# EAGLE design Controller (EAGLE 9.0.1)
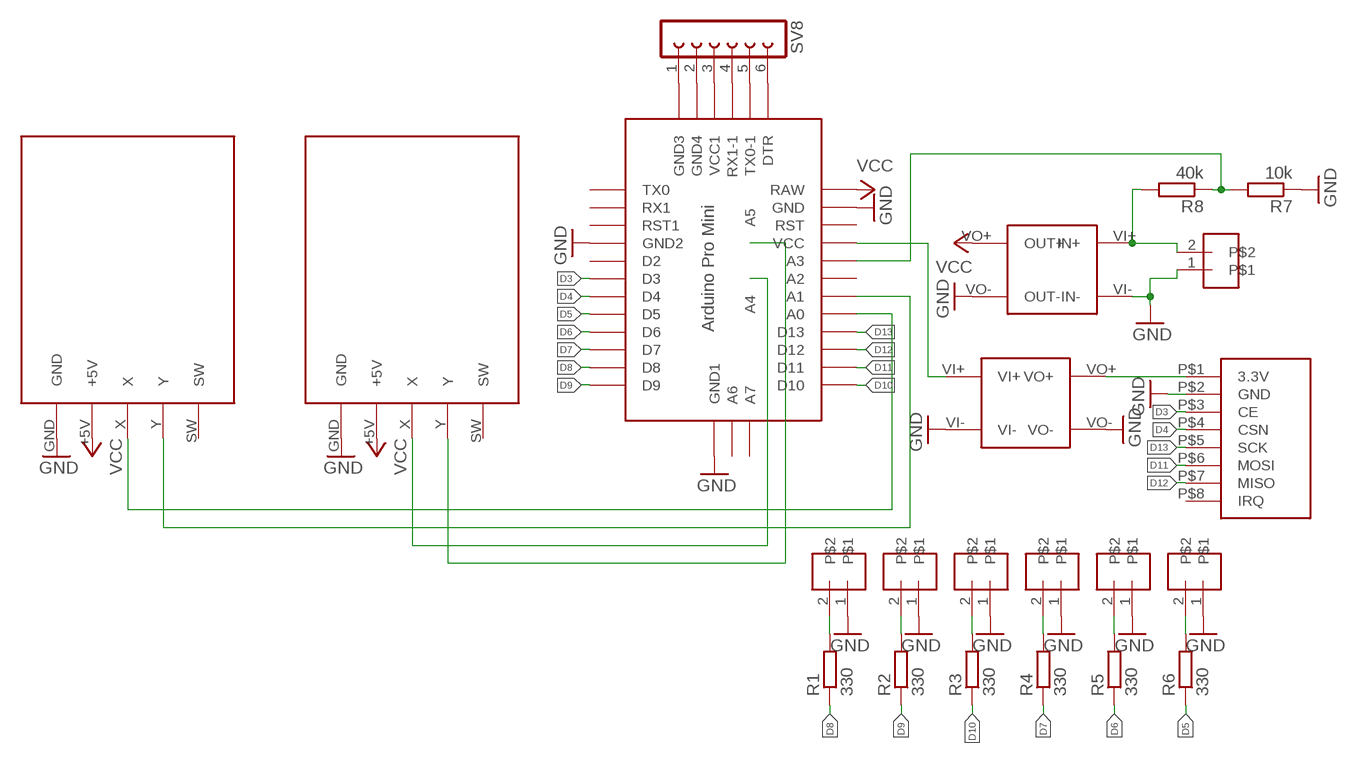
[diagram p0: schematic, sheet 1]

## Parts
R1  330  R-EU_R1206  [R1206]
R2  330  R-EU_R1206  [R1206]
R3  330  R-EU_R1206  [R1206]
R4  330  R-EU_R1206  [R1206]
R5  330  R-EU_R1206  [R1206]
R6  330  R-EU_R1206  [R1206]
R7  10k  R-EU_R1206  [R1206]
R8  40k  R-EU_R1206  [R1206]
SV1  FE05-1  [FE05-1]
SV2  FE05-1  [FE05-1]
SV3  FE05-1  [FE05-1]
SV4  FE05-1  [FE05-1]
SV5  FE05-1  [FE05-1]
SV6  FE05-1  [FE05-1]
SV7  FE05-1  [FE05-1]
SV8  FE06-1  [FE06]
U$1  JOYSTICK  [JOYSTICK]
U$2  JOYSTICK  [JOYSTICK]
U$4  ABK-PRO-MINI  [ABK-PRO-MINI]
U$5  NRF24L01  [NRF24L01]
U$7  3.3V  [3.3V]
U$8  5V  [5V]

## Nets
D3: U$4.P$12(D3) U$5.P$3(CE)
D4: U$4.P$13(D4) U$5.P$4(CSN)
D5: R6.1 U$4.P$14(D5)
D6: R5.1 U$4.P$15(D6)
D7: R4.1 U$4.P$16(D7)
D8: R1.1 U$4.P$17(D8)
D9: R2.1 U$4.P$18(D9)
D10: R3.1 U$4.P$30(D10)
D11: U$4.P$29(D11) U$5.P$6(MOSI)
D12: U$4.P$28(D12) U$5.P$7(MISO)
D13: U$4.P$27(D13) U$5.P$5(SCK)
GND: R7.1 SV1.1 SV2.1 SV3.1 SV4.1 SV5.1 SV6.1 SV7.1 U$1.GND U$2.GND U$4.P$10(GND2) U$4.P$20(GND) U$4.P$33(GND1) U$5.P$2(GND) U$7.VI- U$7.VO- U$8.VI-(IN-) U$8.VO-(OUT-)
N$1: U$1.X U$4.P$26(A0)
N$2: U$1.Y U$4.P$25(A1)
N$3: U$2.X U$4.P$35(A4)
N$4: U$2.Y U$4.P$34(A5)
N$5: R8.2 SV1.2 U$8.VI+(IN+)
N$6: U$4.P$22(VCC) U$7.VI+
N$7: U$5.P$1(3.3V) U$7.VO+
N$8: R1.2 SV7.2
N$9: R2.2 SV6.2
N$10: R3.2 SV5.2
N$11: R4.2 SV4.2
N$12: R5.2 SV3.2
N$13: R6.2 SV2.2
N$14: R7.2 R8.1 U$4.P$23(A3)
N$21: SV8.1 U$4.P$1(GND3)
N$22: SV8.2 U$4.P$2(GND4)
N$23: SV8.3 U$4.P$3(VCC1)
N$24: SV8.4 U$4.P$4(RX1-1)
N$25: SV8.5 U$4.P$5(TX0-1)
N$26: SV8.6 U$4.P$6(DTR)
VCC: U$1.+5V U$2.+5V U$4.P$19(RAW) U$8.VO+(OUT+)
Unconnected: U$1.SW U$2.SW U$4.P$7(TX0) U$4.P$8(RX1) U$4.P$9(RST1) U$4.P$11(D2) U$4.P$21(RST) U$4.P$24(A2) U$4.P$31(A7) U$4.P$32(A6) U$5.P$8(IRQ)

## Library data of the parts
R1-R8 = resistor:R-EU_: RESISTOR, European symbol
SV1-SV7 = con-lsta:FE05-1: FEMALE HEADER; OC_FARNELL: unknown; OC_NEWARK: unknown
SV8 = con-lsta:FE06-1: FEMALE HEADER; OC_FARNELL: unknown; OC_NEWARK: unknown
U$1 U$2 = joystick:JOYSTICK
U$4 = 複製 -Arduino-clone:ABK-PRO-MINI: ABK Pro-Mini Arduino Clone
U$5 = nRF24l01:NRF24L01
U$7 = DC Trans:3.3V
U$8 = DC Trans:5V

## Board
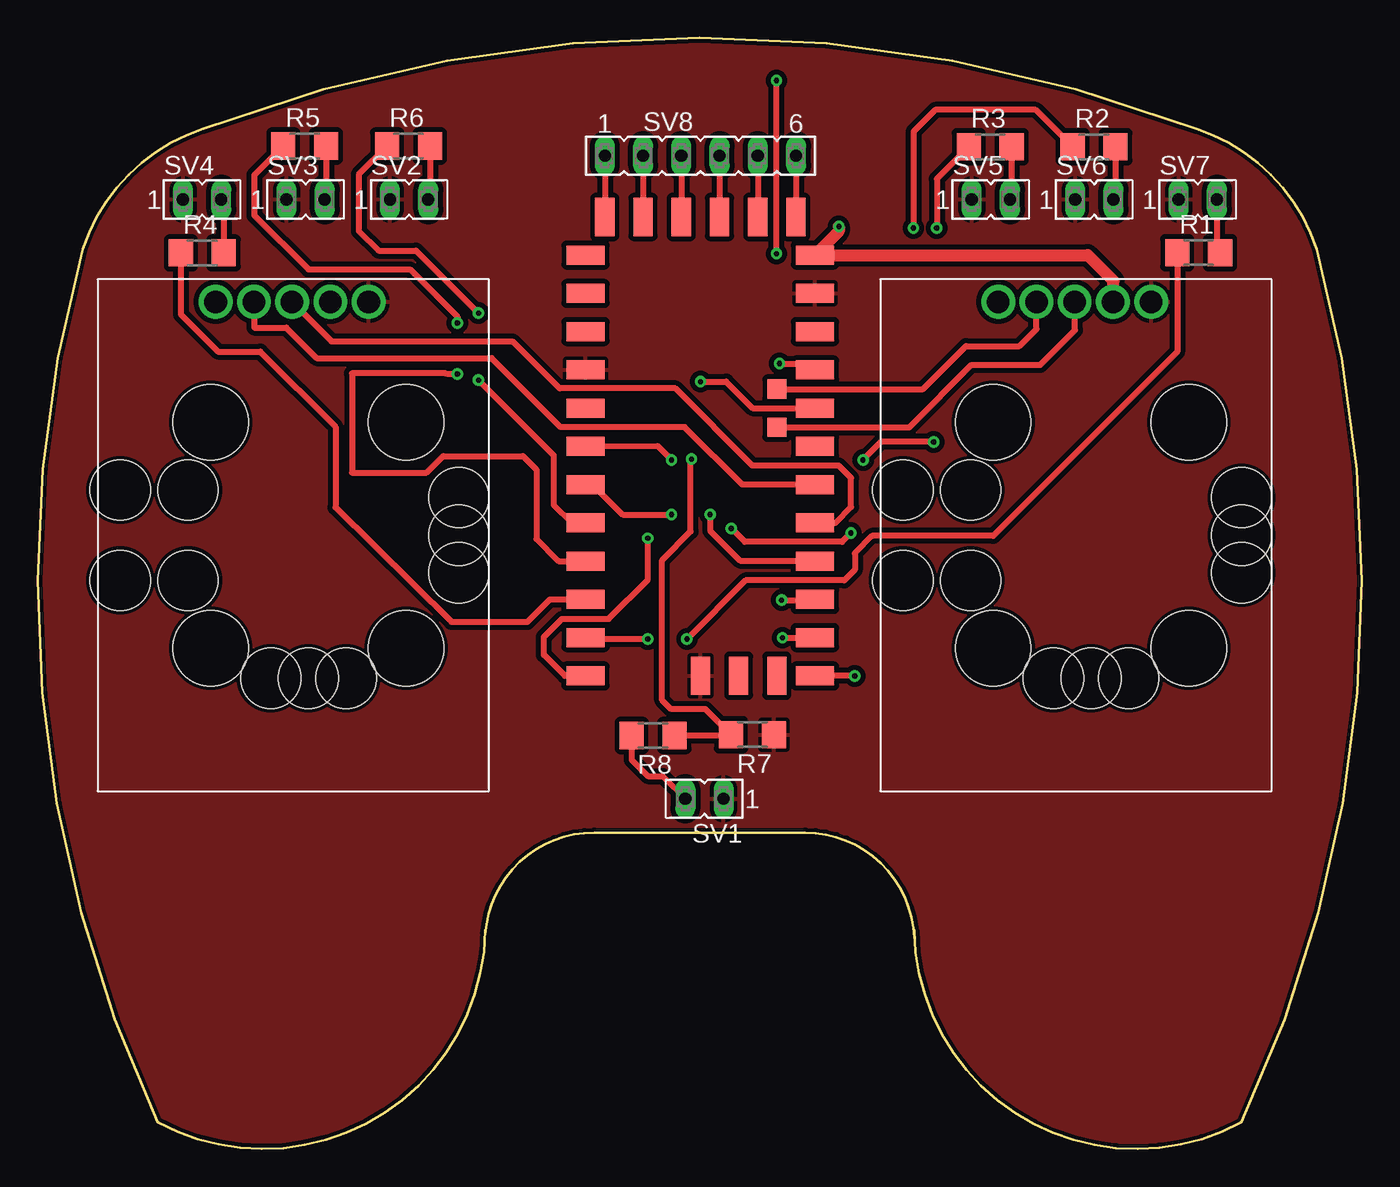
[diagram p1: board, top side]
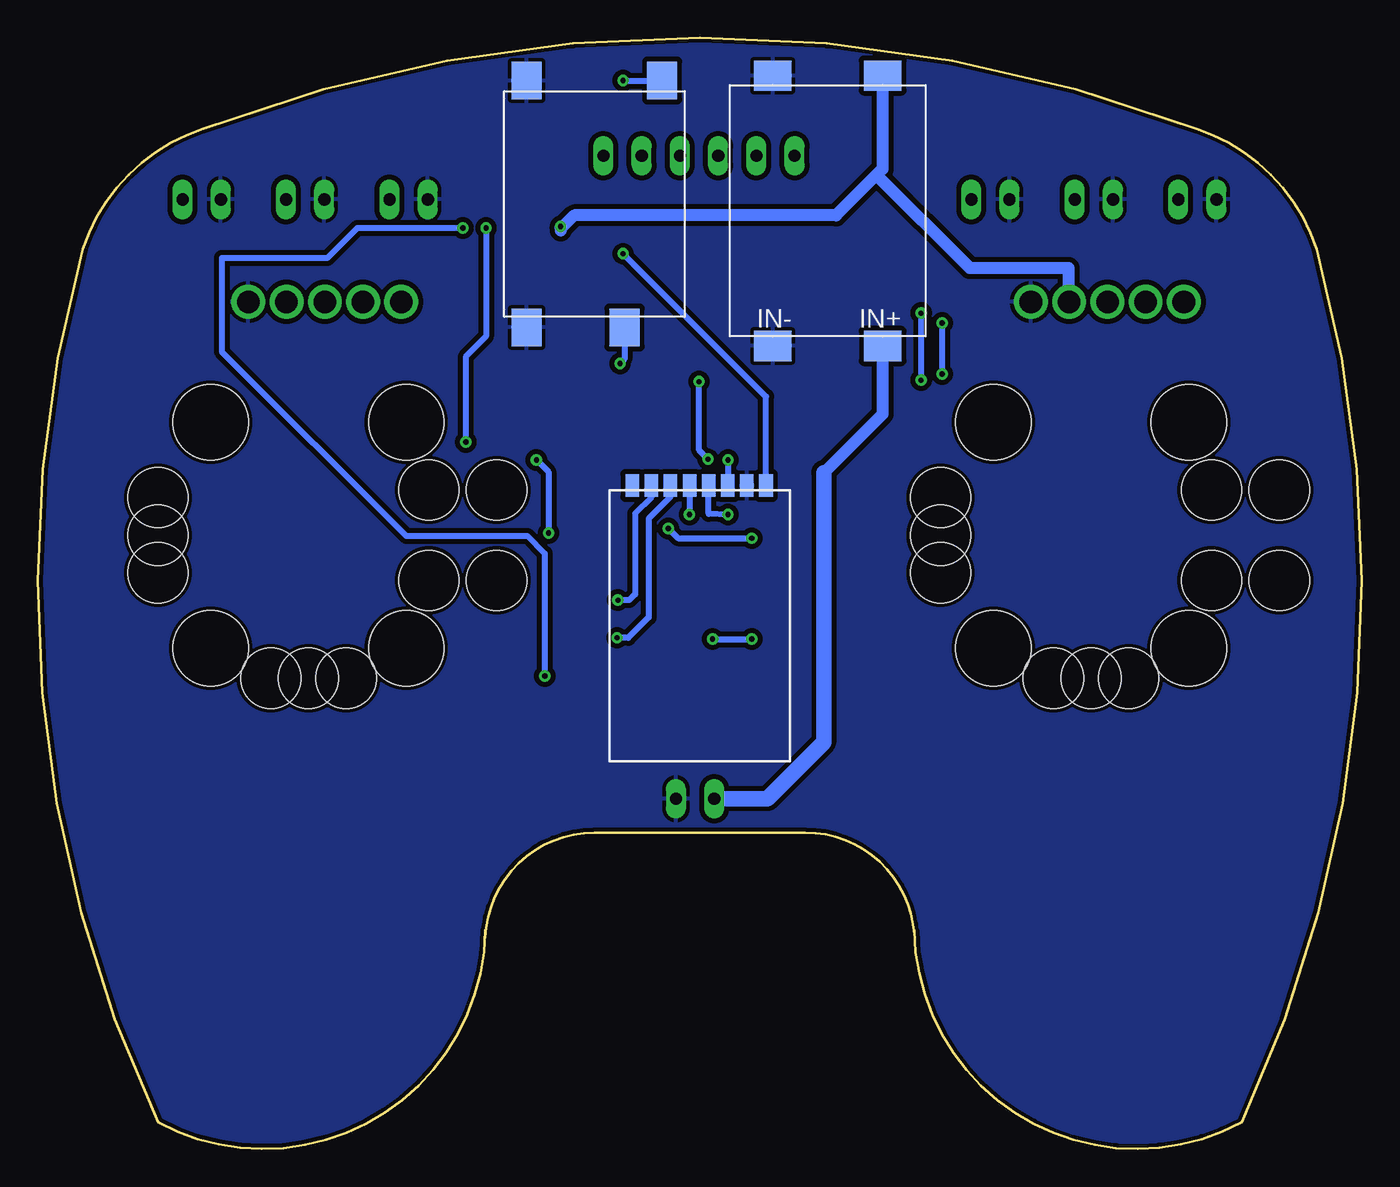
[diagram p2: board, bottom side, seen from below]

Size 87.99 x 73.81 mm. Coordinates in mm from the lower left corner, seen from the top.
Outline: 29.74,14.26 arc-86 36.99,21.01 50.99,21.01 arc-88 58.24,14.01
Outline: 29.74,14.51 arc-117 7.99,1.76 arc-41 2.99,59.76 arc-53 10.99,67.76 arc-42 76.99,67.76 arc-53 84.99,59.76 arc-41 79.99,1.76 arc-117 58.24,14.51
Copper layers (1*16): Top 0.035mm / dielectric 1.5mm / Bottom 0.035mm
Design rules "default *": minimum track width 6mil, minimum drill 0.35mm, track to track 13mil, track to pad 13mil, pad to pad 13mil, via to via 13mil, smd to smd 6mil, copper to edge 10mil, drill to drill 6mil, minimum pad ring 10mil, minimum via ring 8mil, stop-mask expansion 4mil, vias tented up to drill 0mil, thermal gap 10mil

### Footprints (pad centres in the part's own frame; a part is rotated, then mirrored left to right if it is on the bottom)
R1206 = smd 1.6 x 1.803: 1 -1.422,0; 2 1.422,0
FE05-1 = drill 0.813 long: 1 -5.08,0; 2 -2.54,0
FE06 = drill 0.813 long: 1 -6.35,0; 2 -3.81,0; 3 -1.27,0; 4 1.27,0; 5 3.81,0; 6 6.35,0
JOYSTICK = drill 1.5 pad 2: +5V 1.5,15.46; GND 1.5,18; SW 1.5,7.84; X 1.5,12.91; Y 1.5,10.38 | hole 5: 9.5,7.5; 9.5,20.5; 24.5,7.5; 24.5,20.5 | hole 4: 14,1.5; 20,1.5; 20,6; 14,6; 26.5,11.5; 26.5,14; 26.5,16.5; 14.5,24; 17,24; 19.5,24
ABK-PRO-MINI = smd 1.27 x 2.54: P$1 -3.81,8.89; P$2 -1.27,8.89; P$3 1.27,8.89; P$4 3.81,8.89; P$5 6.35,8.89; P$6 8.89,8.89; P$31 7.62,-21.59; P$32 5.08,-21.59; P$33 2.54,-21.59 | smd 2.54 x 1.27: P$7 -5.08,6.35; P$8 -5.08,3.81; P$9 -5.08,1.27; P$10 -5.08,-1.27; P$11 -5.08,-3.81; P$12 -5.08,-6.35; P$13 -5.08,-8.89; P$14 -5.08,-11.43; P$15 -5.08,-13.97; P$16 -5.08,-16.51; P$17 -5.08,-19.05; P$18 -5.08,-21.59; P$19 10.16,6.35; P$20 10.16,3.81; P$21 10.16,1.27; P$22 10.16,-1.27; P$23 10.16,-3.81; P$24 10.16,-6.35; P$25 10.16,-8.89; P$26 10.16,-11.43; P$27 10.16,-13.97; P$28 10.16,-16.51; P$29 10.16,-19.05; P$30 10.16,-21.59 | smd 1.27 x 1.27: P$34 7.62,-2.54; P$35 7.62,-5.08
NRF24L01 = smd 0.9 x 1.5: P$1 1.6,-0.3; P$2 2.87,-0.3; P$3 4.14,-0.3; P$4 5.41,-0.3; P$5 6.68,-0.3; P$6 7.95,-0.3; P$7 9.22,-0.3; P$8 10.49,-0.3
3.3V = smd 2.5 x 2: VI+ 15.7,8; VI- 15.7,1.5; VO+ -0.7,10.5; VO- -0.7,1.5
5V = smd 2 x 2.5: VI+ -0.63,2.85; VI- -0.63,10.15; VO+ 17.33,2.85; VO- 17.33,10.15

### Placement (x,y rotation side)
R1  77.14,59.52 0 top
R2  70.19,66.56 0 top
R3  63.29,66.56 0 top
R4  10.94,59.51 0 top
R5  17.74,66.61 0 top
R6  24.64,66.61 0 top
R7  47.49,27.51 180 top
R8  40.89,27.46 180 top
SV1  40.49,23.26 180 top
SV2  28.49,63.06 0 top
SV3  21.62,63.06 0 top
SV4  14.74,63.06 0 top
SV5  67.14,63.06 0 top
SV6  74.02,63.06 0 top
SV7  80.89,63.06 0 top
SV8  44.04,65.96 0 top
U$1  3.99,57.76 270 top
U$2  55.99,57.76 270 top
U$4  41.49,53.01 0 top
U$5  37.99,43.76 180 bottom
U$7  56.99,70.26 270 bottom
U$8  28.99,53.96 90 bottom

### Tracks (layer width: path | path; a pad name or v marks a point on that pad's centre or on a via)
D3  (via drill 0.35)
  Top 0.406: U$4.P$12 41.19,46.7 v42.12,45.76
  Bottom 0.406: v42.12,45.76 42.13,45.75 U$5.P$3
D4  (via drill 0.35)
  Top 0.406: U$4.P$13 36.88,44.12 38.87,42.14 v42.12,42.14
  Bottom 0.406: v42.12,42.14 43.4,42.17 U$5.P$4
D5  (via drill 0.35)
  Top 0.406: R6.1 21.34,64.73 21.34,60.96 22.64,59.66 25.14,59.66 v29.29,55.51 | v29.29,51.06 34.29,46.06 34.29,42.76 35.47,41.58 U$4.P$14
  Bottom 0.406: v29.29,55.51 v29.29,51.06
D6  (via drill 0.35)
  Top 0.406: R5.1 14.39,64.68 14.39,62.01 17.99,58.41 24.74,58.41 27.89,55.26 v27.89,54.86 | v27.89,51.46 27.24,51.46 27.09,51.51 20.89,51.51 20.89,44.91 25.84,44.91 26.94,46.01 32.24,46.01 33.14,45.11 33.14,40.51 34.61,39.04 U$4.P$15
  Bottom 0.406: v27.89,54.86 v27.89,51.46
D7
  Top 0.406: R4.1 9.52,55.43 11.99,52.96 14.79,52.96 19.79,47.96 19.79,42.61 27.49,35.01 32.54,35.01 34.03,36.5 U$4.P$16
D8  (via drill 0.35)
  Top 0.406: R1.1 75.72,52.94 63.49,40.71 55.44,40.71 54.29,39.56 54.29,38.46 53.59,37.76 47.04,37.76 v43.14,33.86 | v40.54,33.86 36.51,33.86 U$4.P$17
  Bottom 0.406: v43.14,33.86 v40.54,33.86
D9  (via drill 0.35)
  Top 0.406: R2.1 66.32,69.01 59.64,69.01 58.19,67.56 v58.19,61.16 58.19,61.11 | v59.54,46.96 56.04,46.96 v54.84,45.76 | v54.04,40.91 53.44,40.31 46.99,40.31 v46.09,41.21 | U$4.P$18 35.03,31.42 33.64,32.81 33.64,34.01 34.84,35.21 37.94,35.21 40.54,37.81 v40.54,40.56 40.54,40.61
  Bottom 0.406: v58.19,61.16 58.19,53.96 59.54,52.61 v59.54,46.96 | v54.84,45.76 54.04,44.96 v54.04,40.91 | v46.09,41.21 45.44,40.56 v40.54,40.56
D10  (via drill 0.35)
  Top 0.406: v54.29,31.41 U$4.P$30 | R3.1 59.74,64.43 v59.74,61.16
  Bottom 0.406: v54.29,31.41 54.29,39.56 55.44,40.71 63.49,40.71 75.74,52.96 75.74,59.16 68.74,59.16 66.74,61.16 v59.74,61.16
D11  (via drill 0.35)
  Top 0.406: v49.49,33.95 51.64,33.95 U$4.P$29
  Bottom 0.406: U$5.P$6 45.94,43.31 47.39,41.86 47.39,35.31 48.75,33.95 v49.49,33.95
D12  (via drill 0.35)
  Top 0.406: v49.43,36.45 51.6,36.45 U$4.P$28
  Bottom 0.406: v49.43,36.45 48.68,36.45 48.29,36.84 48.29,42.21 47.21,43.29 U$5.P$7
D13  (via drill 0.35)
  Top 0.406: v44.68,42.14 44.68,41.07 46.68,39.07 51.62,39.07 U$4.P$27
  Bottom 0.406: U$5.P$5 44.67,42.21 v44.68,42.14
GND
  pour Top: -6.26,-19.49 -6.26,81.09 94.32,81.09 94.32,-19.49
  pour Bottom: -6.26,81.09 -6.26,-19.49 94.32,-19.49 94.32,81.09 93.05,81.09
N$1
  Top 0.406: 52.73,41.58 U$4.P$26 53,41.58 54.05,42.64 54.05,44.57 53.24,45.39 47.49,45.39 42.37,50.51 34.68,50.51 31.55,53.64 19.53,53.64 U$1.X
N$2
  Top 0.406: 52.07,44.12 U$4.P$25 46.82,44.12 42.99,47.95 34.74,47.95 30.17,52.52 18.54,52.52 16.52,54.54 14.39,54.54 U$1.Y
N$3
  Top 0.406: U$4.P$35 57.91,47.93 62.05,52.07 66.62,52.07 68.93,54.39 68.9,54.66 U$2.X
N$4
  Top 0.406: U$4.P$34 58.83,50.47 61.68,53.32 65.24,53.32 66.37,54.45 U$2.Y
N$5
  Top 0.406: R8.2 39.47,25.83 40.54,24.76 41.53,24.76 SV1.2
  Bottom 0.813: U$8.VI+ 31.84,48.81 35.74,44.91
  Bottom 1.016: SV1.2 39.49,23.26 35.74,27.01 35.74,44.91
N$6  (via drill 0.35)
  Top 0.406: 51.69,51.7 U$4.P$22 51.23,52.16 v49.29,52.16
  Bottom 0.406: U$7.VI+ 48.99,52.46 v49.29,52.16
N$7  (via drill 0.35)
  Top 0.406: v49.09,59.46 v49.09,70.96
  Bottom 0.406: U$5.P$1 39.59,49.96 v49.09,59.46 | v49.09,70.96 U$7.VO+
N$8
  Top 0.406: SV7.2 78.35,59.74 R1.2
N$9
  Top 0.406: R2.2 71.61,63.2 SV6.2
N$10
  Top 0.406: R3.2 64.71,63.17 SV5.2
N$11
  Top 0.406: SV4.2 12.36,62.9 R4.2
N$12
  Top 0.406: R5.2 19.16,63.15 SV3.2
N$13
  Top 0.406: R6.2 26.06,63.17 SV2.2
N$14  (via drill 0.35)
  Top 0.406: R8.1 46.02,27.46 R7.2 44.37,29.21 42.09,29.21 41.49,29.81 41.49,39.11 43.39,41.01 43.39,45.76 v43.44,45.81 | v44.04,50.96 45.74,50.96 47.5,49.2 U$4.P$23
  Bottom 0.406: v43.44,45.81 44.04,46.41 v44.04,50.96
N$21
  Top 0.406: SV8.1 U$4.P$1
N$22
  Top 0.406: SV8.2 U$4.P$2
N$23
  Top 0.406: SV8.3 U$4.P$3
N$24
  Top 0.406: SV8.4 U$4.P$4
N$25
  Top 0.406: SV8.5 U$4.P$5
N$26
  Top 0.406: SV8.6 U$4.P$6
VCC  (via drill 0.35)
  Top 0.813: v53.24,61.26 53.24,60.95 U$4.P$19 69.77,59.36 71.49,57.64 71.45,57.6 U$2.+5V
  Bottom 0.813: 53.24,61.11 v53.24,61.26 | U$1.+5V 19.49,56.3 19.49,58.51 26.05,58.51 32.24,64.7 | 32.24,64.7 34.93,62.01 52.34,62.01 53.24,61.11 | 53.24,61.11 53.24,61.01 | U$8.VO+ 31.84,65.1 32.24,64.7